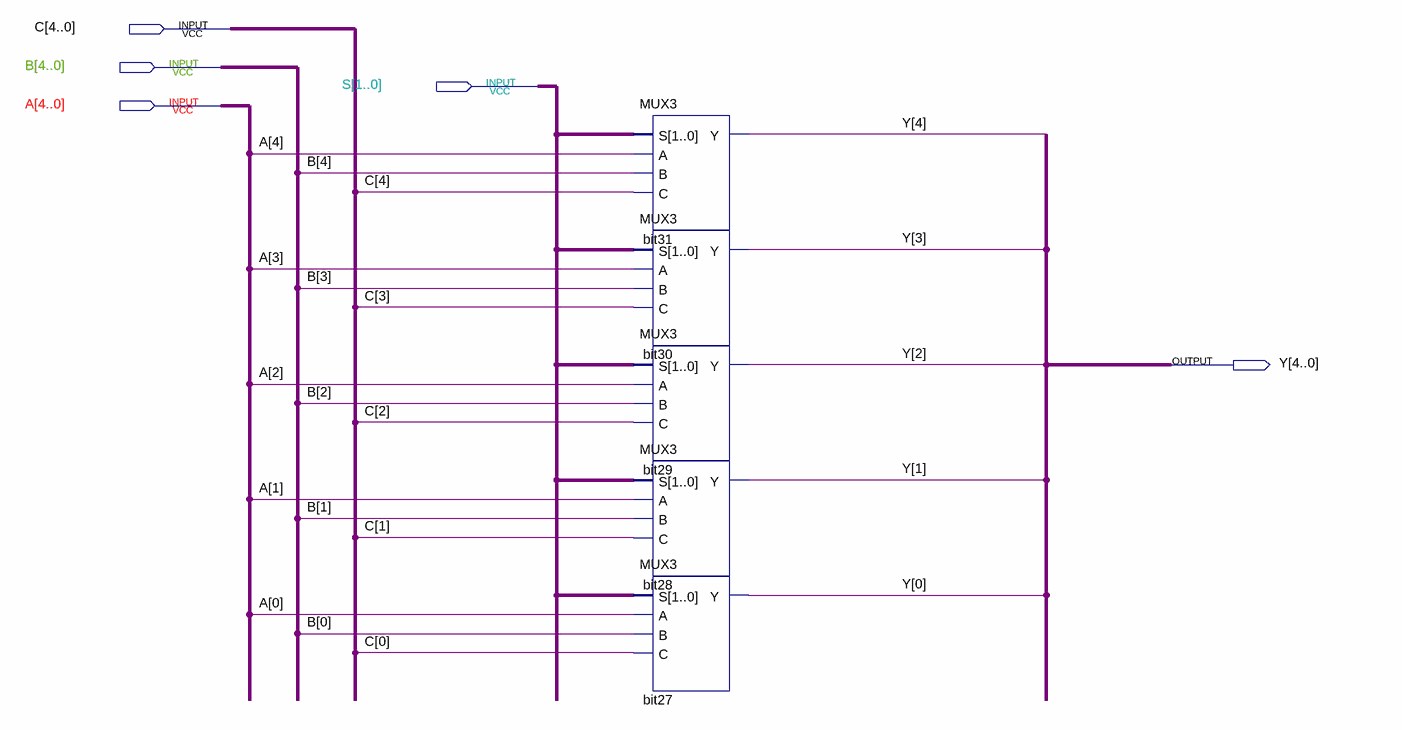
[diagram p0: schematic sheet]
// Quartus schematic MUX3_5.bdf as structural Verilog: 5 symbols, 5 pins
module MUX3_5 (
  input  [4:0] C,
  input  [4:0] B,
  input  [1:0] S,
  input  [4:0] A,
  output [4:0] Y
);

  MUX3 bit31 (.S(S), .A(A[4]), .B(B[4]), .C(C[4]), .Y(Y[4]));
  MUX3 bit30 (.S(S), .A(A[3]), .B(B[3]), .C(C[3]), .Y(Y[3]));
  MUX3 bit29 (.S(S), .A(A[2]), .B(B[2]), .C(C[2]), .Y(Y[2]));
  MUX3 bit28 (.S(S), .A(A[1]), .B(B[1]), .C(C[1]), .Y(Y[1]));
  MUX3 bit27 (.S(S), .A(A[0]), .B(B[0]), .C(C[0]), .Y(Y[0]));
endmodule
